# EAGLE design BOSS-RoboClaw-Interface (EAGLE 9.6.2)
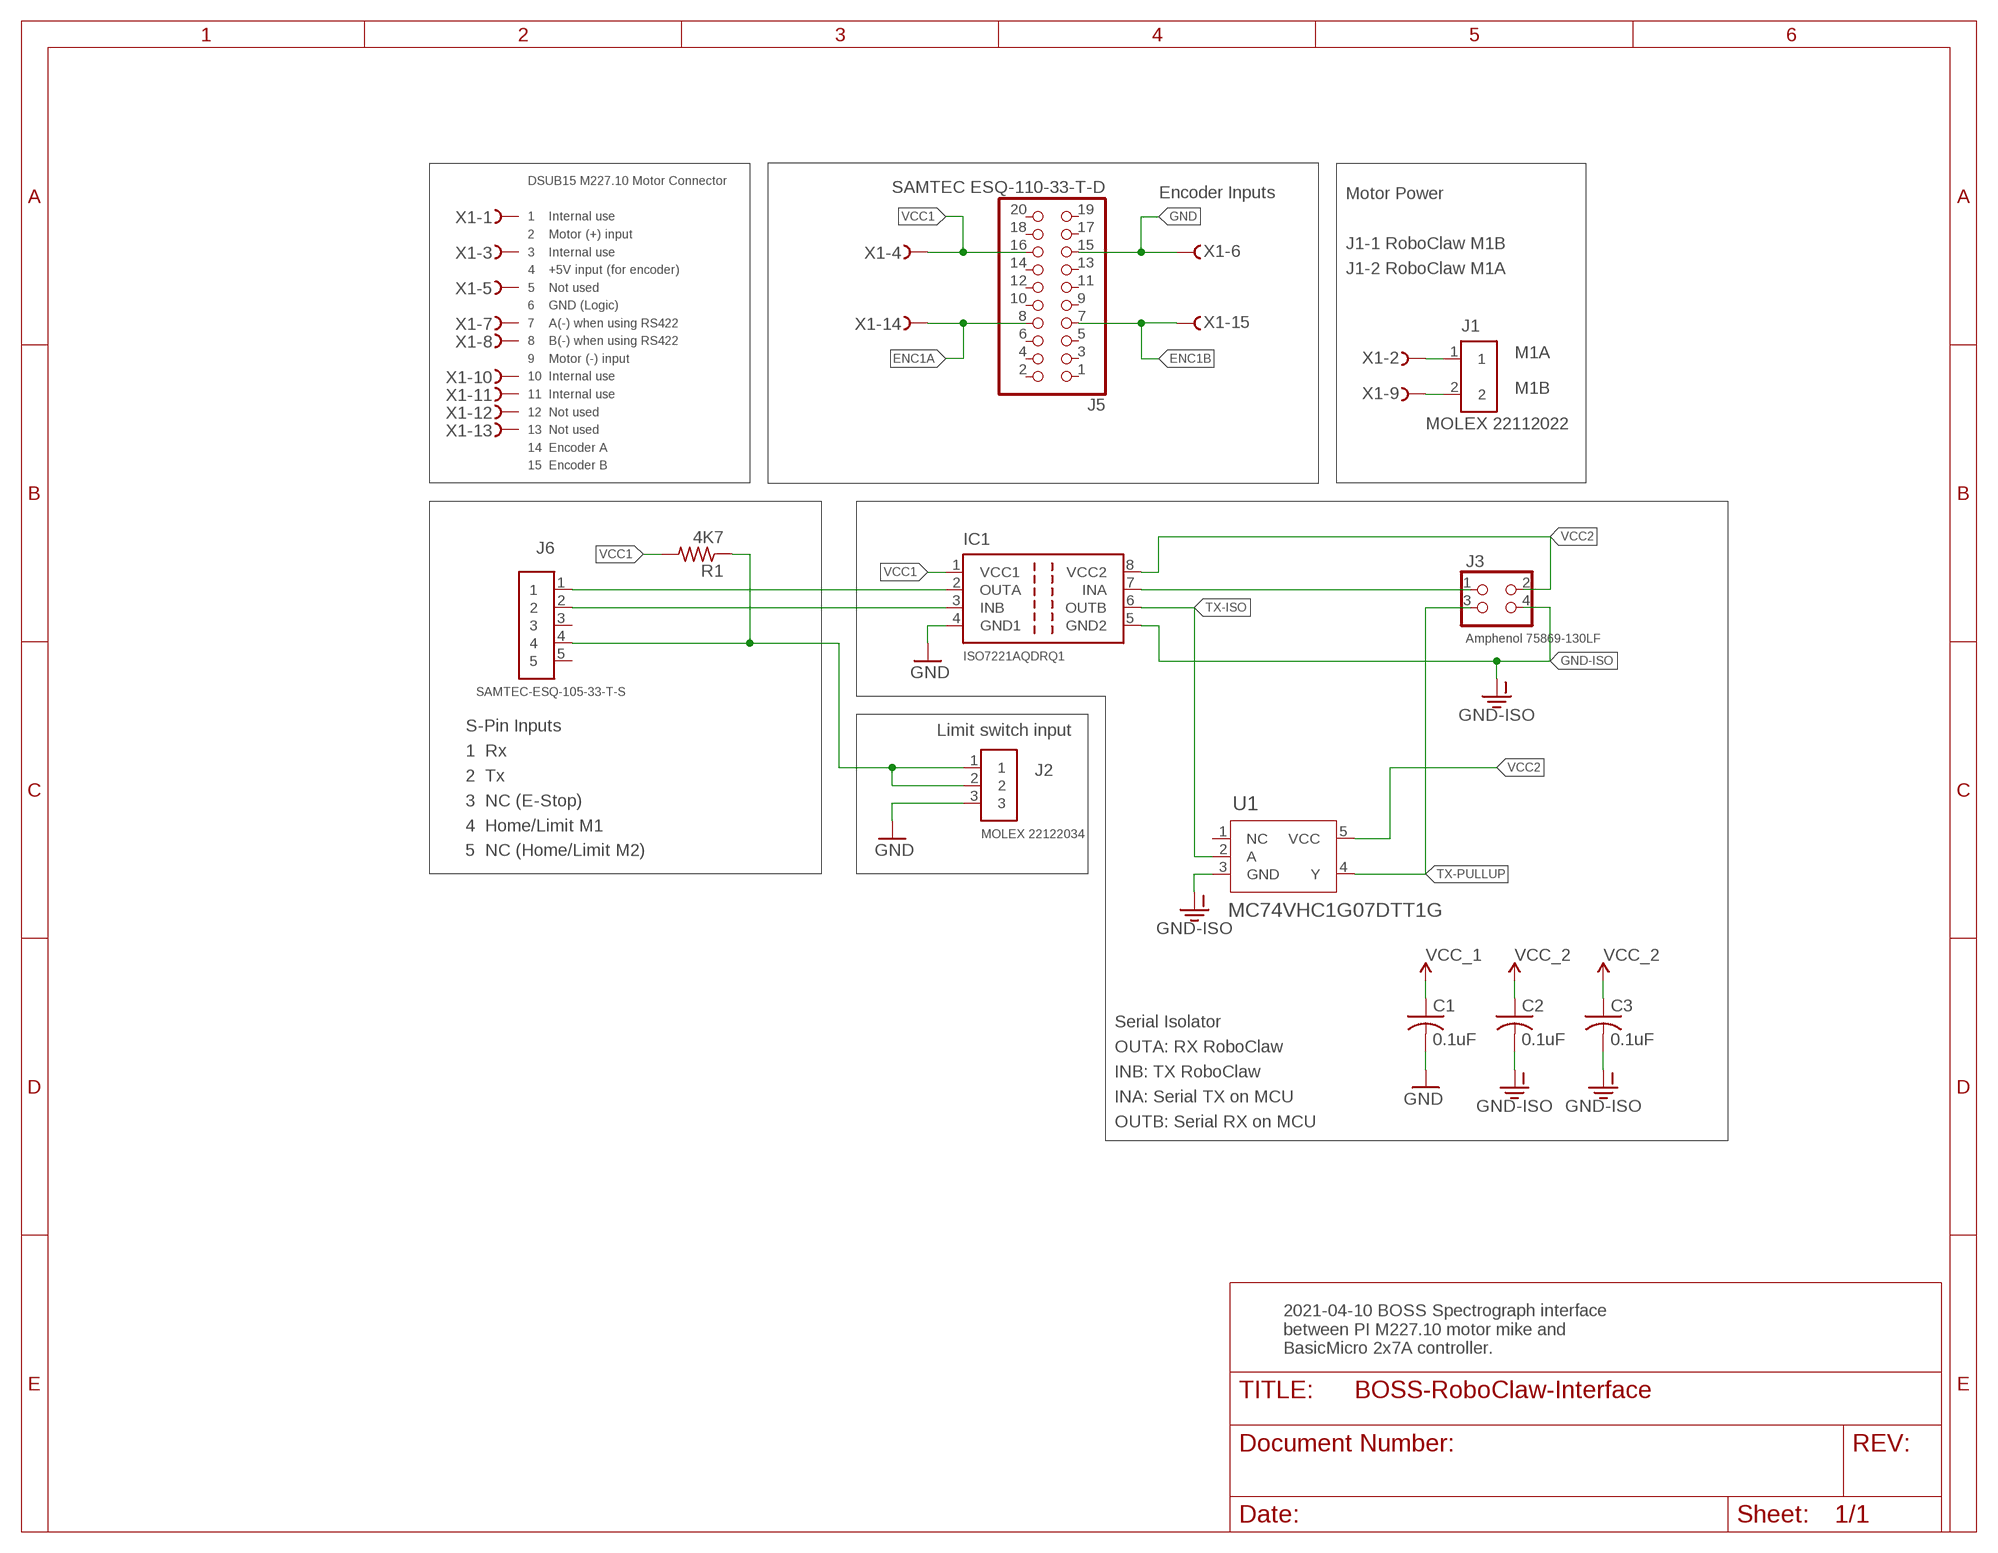
[diagram p0: schematic, sheet 1]

## Parts
C1  0.1uF  C-USC0805  [C0805]
C2  0.1uF  C-USC0805  [C0805]
C3  0.1uF  C-USC0805  [C0805]
IC1  ISO7221AQDRQ1  ISO7221ISO7221  [SO-08-ISO7221]
J1  MOLEX 22112022  PINHD-1X2-MOLEX-22112022  [1X02-MOLEX-22112022]
J2  MOLEX 22122034  PINHD-1X3RA-MOLEX-22122034  [1X03RA-MOLEX-22122034]
J3  Amphenol 75869-130LF  PINHD-2X2AMP-75869-130LF  [2X02-SHROUD]
J5  SAMTEC ESQ-110-33-T-D  PINHD-2X10-ESQ-110-33-T-DSAMTEC  [2X10-ESQ-110-33-T-D]
J6  SAMTEC-ESQ-105-33-T-S  PINHD-1X5-ESQ-105-33-T-S  [1X05-ESQ-105-33-T-S]
R1  4K7  R-US_R0805  [R0805]
U1  MC74VHC1G07DTT1G  MC74VHC1G07DTT1GSOT23-5_ONS-M  [SOT23-5_ONS-M]
X1  Amphenol L77SDAH15SOL2RM8C309  D-SUB15-H2R15ST  [H2R15ST]

## Nets
ENC1A: J5.8 X1.14
ENC1B: J5.7 X1.15
GND: C1.2 IC1.4(GND1) J2.3 J5.15 X1.6
GND-ISO: C2.2 C3.2 IC1.5(GND2) J3.4 U1.3(GND)
LIMIT: J2.1 J2.2 J6.4 R1.1
M1A: J1.1 X1.2
M1B: J1.2 X1.9
ROBO-RX: IC1.2(OUTA) J6.1
ROBO-TX: IC1.3(INB) J6.2
RX: IC1.7(INA) J3.1
TX-ISO: IC1.6(OUTB) U1.2(A)
TX-PULLUP: J3.3 U1.4(Y)
VCC1: C1.1 IC1.1(VCC1) J5.16 R1.2 X1.4 ; supply symbol labelled VCC_1
VCC2: C2.1 C3.1 IC1.8(VCC2) J3.2 U1.5(VCC) ; supply symbol labelled VCC_2
Unconnected: J5.1 J5.2 J5.3 J5.4 J5.5 J5.6 J5.9 J5.10 J5.11 J5.12 J5.13 J5.14 J5.17 J5.18 J5.19 J5.20 J6.3 J6.5 U1.1(NC) X1.1 X1.3 X1.5 X1.7 X1.8 X1.10 X1.11 X1.12 X1.13

## Notes on the sheet
- Encoder Inputs
- Motor Power
  
  J1-1 RoboClaw M1B
  J1-2 RoboClaw M1A
- DSUB15 M227.10 Motor Connector
  
  1    Internal use
  2    Motor (+) input
  3    Internal use
  4    +5V input (for encoder)
  5    Not used
  6    GND (Logic)
  7    A(-) when using RS422
  8    B(-) when using RS422
  9    Motor (-) input
  10  Internal use
  11  Internal use
  12  Not used
  13  Not used
  14  Encoder A
  15  Encoder B
- Limit switch input
- S-Pin Inputs
  1  Rx
  2  Tx
  3  NC (E-Stop)
  4  Home/Limit M1
  5  NC (Home/Limit M2)
- Serial Isolator
  OUTA: RX RoboClaw
  INB: TX RoboClaw
  INA: Serial TX on MCU
  OUTB: Serial RX on MCU
- 2021-04-10 BOSS Spectrograph interface
  between PI M227.10 motor mike and
  BasicMicro 2x7A controller.

## Library data of the parts
C1-C3 = AUmlib:C-US: CAPACITOR, American symbol; SPICEPREFIX: C
IC1 = AUmlib:ISO7221: DUAL DIGITAL ISOLATORS Source: http://focus.ti.com/lit/ds/symlink/iso7221a.pdf
J1 = AUmlib:PINHD-1X2-MOLEX-22112022
J2 = AUmlib:PINHD-1X3RA-MOLEX-22122034
J3 = AUmlib:PINHD-2X2: PIN HEADER
J5 = AUmlib:PINHD-2X10-ESQ-110-33-T-D: PIN HEADER
J6 = AUmlib:PINHD-1X5-ESQ-105-33-T-S
R1 = AUmlib:R-US_: RESISTOR, American symbol; SPICEPREFIX: R
U1 = AUmlib:MC74VHC1G07DTT1G; COPYRIGHT: Copyright (C) 2022 Ultra Librarian. All rights reserved.; DIGI-KEY_PART_NUMBER_1: MC74VHC1G07DTT1GOSCT-ND; DIGI-KEY_PART_NUMBER_2: MC74VHC1G07DTT1GOSDKR-ND; DIGI-KEY_PART_NUMBER_3: MC74VHC1G07DTT1GOSTR-ND; DIGI-KEY_PART_NUMBER_4: 2156-MC74VHC1G07DTT1G-OS-ND; MANUFACTURER_PART_NUMBER: MC74VHC1G07DTT1G; MFR_NAME: onsemi
X1 = AUmlib:D-SUB15-: D-Subminiatur Connector Source: Electronioc Interconnects European Edition 1998; OC_FARNELL: unknown; OC_NEWARK: unknown

## Board
Basic Micro 2x7A RoboClaw interface to PI M-227.10 motor mikel.
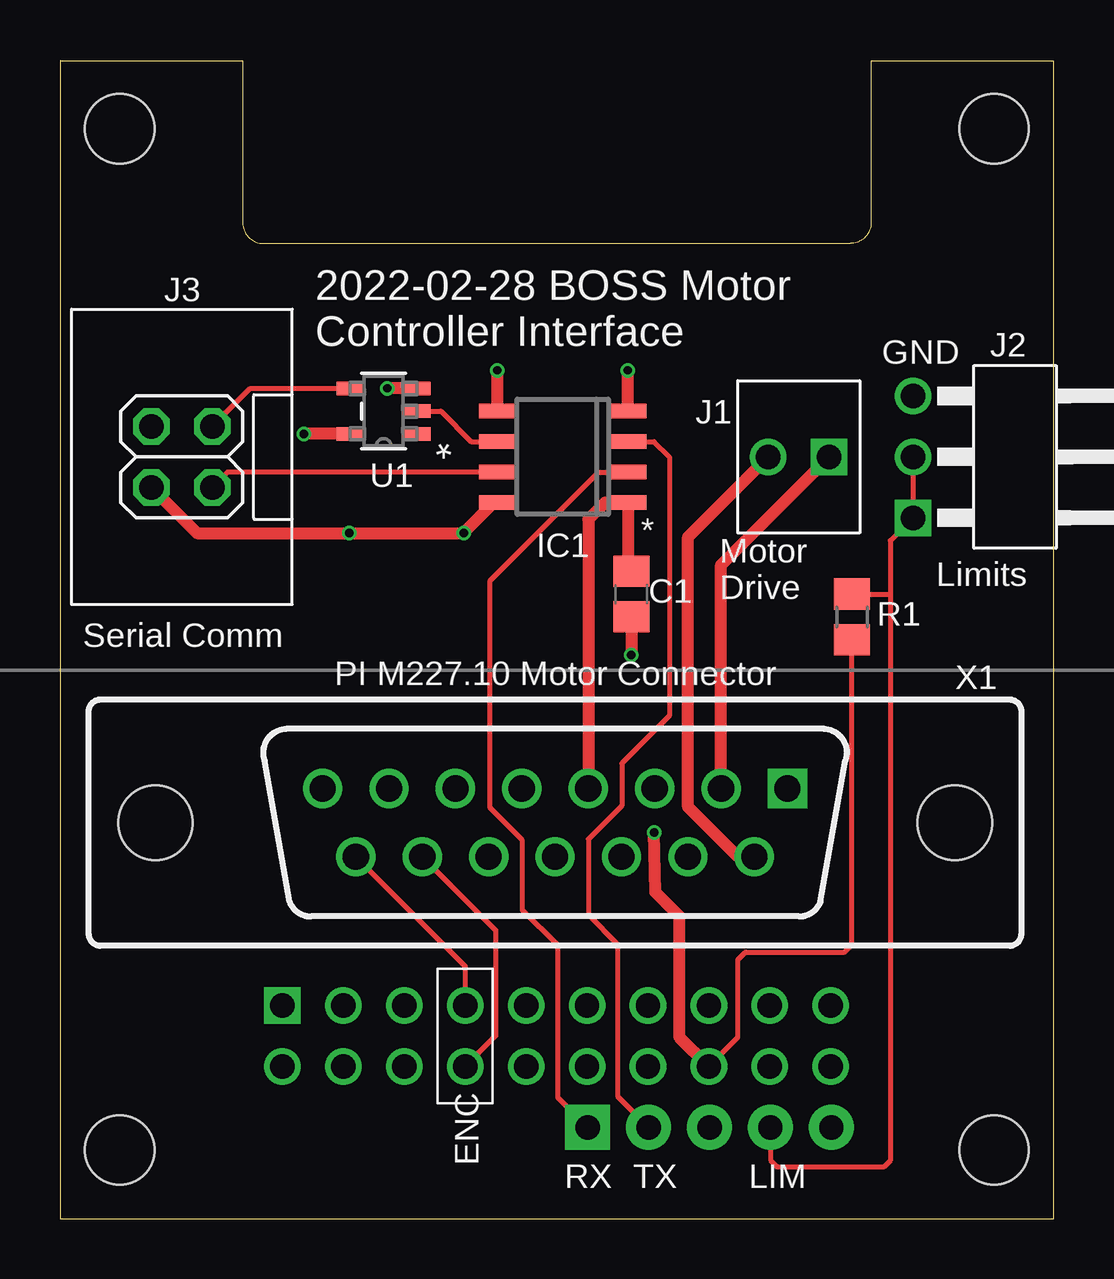
[diagram p1: board, top side]
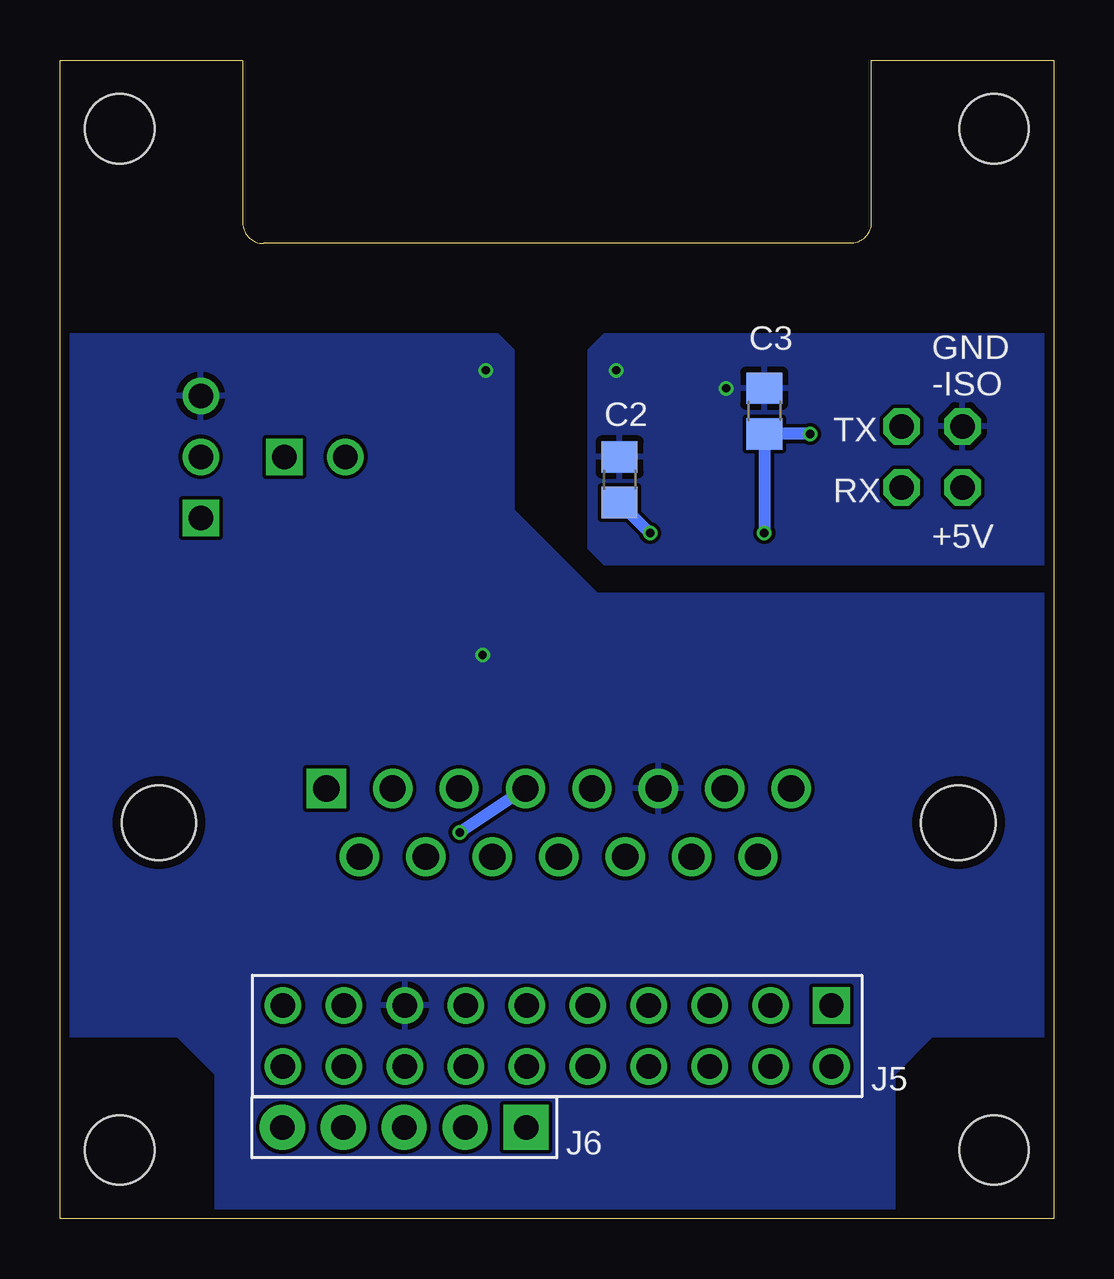
[diagram p2: board, bottom side, seen from below]

Size 41.43 x 48.29 mm. Coordinates in mm from the lower left corner, seen from the top.
Outline: 0,48.28 0,48.26
Outline: 0,48.26 0,0 41.43,0 41.43,48.26 33.81,48.26 33.81,41.5 arc-90 32.94,40.64 8.48,40.64 arc-90 7.62,41.5 7.62,48.26 0,48.26
Copper layers (1*16): Top 0.035559375mm / dielectric 1.6mm / Bottom 0.035559375mm
Design rules "oshpark-2layer": minimum track width 6mil, minimum drill 10mil, track to track 6mil, track to pad 6mil, pad to pad 6mil, via to via 6mil, smd to smd 6mil, copper to edge 15mil, drill to drill 6mil, minimum pad ring 5mil, minimum via ring 5mil, stop-mask expansion 2.5mil, vias tented up to drill 0mil, thermal gap 10mil
Holes 2.9 mm at 2.49,2.87 2.49,45.42 38.94,45.42 38.94,2.87

### Footprints (pad centres in the part's own frame; a part is rotated, then mirrored left to right if it is on the bottom)
C0805 = smd 1.3 x 1.5: 1 -0.95,0; 2 0.95,0
SO-08-ISO7221 = smd 1.549 x 0.61: 1 -2.718,1.905; 2 -2.718,0.635; 3 -2.718,-0.635; 4 -2.718,-1.905; 5 2.718,-1.905; 6 2.718,-0.635; 7 2.718,0.635; 8 2.718,1.905
1X02-MOLEX-22112022 = drill 1.016 square: 1 -1.27,0 | drill 1.016: 2 1.27,0
1X03RA-MOLEX-22122034 = drill 1.016 square: 1 -2.54,3.81 | drill 1.016: 2 0,3.81; 3 2.54,3.81
2X02-SHROUD = drill 1.016 octagon: 1 -1.27,-1.27; 2 -1.27,1.27; 3 1.27,-1.27; 4 1.27,1.27
2X10-ESQ-110-33-T-D = drill 1.016 square: 1 -11.43,-1.27 | drill 1.016: 2 -11.43,1.27; 3 -8.89,-1.27; 4 -8.89,1.27; 5 -6.35,-1.27; 6 -6.35,1.27; 7 -3.81,-1.27; 8 -3.81,1.27; 9 -1.27,-1.27; 10 -1.27,1.27; 11 1.27,-1.27; 12 1.27,1.27; 13 3.81,-1.27; 14 3.81,1.27; 15 6.35,-1.27; 16 6.35,1.27; 17 8.89,-1.27; 18 8.89,1.27; 19 11.43,-1.27; 20 11.43,1.27
1X05-ESQ-105-33-T-S = drill 1.016 pad 1.88 square: 1 -5.08,0 | drill 1.016 pad 1.88: 2 -2.54,0; 3 0,0; 4 2.54,0; 5 5.08,0
R0805 = smd 1.3 x 1.5: 1 -0.95,0; 2 0.95,0
SOT23-5_ONS-M = smd 1.156 x 0.559: 1 -1.378,0.95; 2 -1.378,0; 3 -1.378,-0.95; 4 1.378,-0.95; 5 1.378,0.95
H2R15ST = drill 1.092 square: 1 9.69,1.422 | drill 1.092: 2 6.921,1.422; 3 4.153,1.422; 4 1.384,1.422; 5 -1.384,1.422; 6 -4.153,1.422; 7 -6.921,1.422; 8 -9.69,1.422; 9 8.306,-1.422; 10 5.537,-1.422; 11 2.769,-1.422; 12 0,-1.422; 13 -2.769,-1.422; 14 -5.537,-1.422; 15 -8.306,-1.422 | hole 3.1: -16.662,0; 16.662,0

### Placement (x,y rotation side)
C1  23.81,26.04 270 top
C2  18.1,30.8 90 bottom
C3  12.06,33.66 90 bottom
IC1  20.95,31.75 180 top
J1  30.8,31.75 180 top
J2  39.37,31.75 90 top
J3  5.08,31.75 90 top
J5  20.7,7.62 180 bottom
J6  27.08,3.81 180 bottom
R1  33.02,25.08 270 top
U1  13.49,33.66 180 top
X1  20.64,16.51 0 top

### Tracks (layer width: path | path; a pad name or v marks a point on that pad's centre or on a via)
ENC1A
  Top 0.203: X1.14 18.16,12.03 18.16,7.62 J5.8
ENC1B
  Top 0.203: X1.15 16.89,10.53 J5.7
GND  (via drill 0.35)
  Top 0.508: IC1.4 v23.67,35.36 | C1.2 v23.81,23.5
  pour Bottom: 22.54,36.2 23.18,36.83 41.43,36.83 41.43,7.62 36.51,7.62 34.92,6.03 34.92,0 6.67,0 6.67,6.03 5.08,7.62 0,7.62 0,26.04 19.05,26.04 22.54,29.53
GND-ISO  (via drill 0.35)
  Top 0.508: IC1.5 v18.24,35.36 | U1.3 v13.65,34.6 v13.65,34.61
  pour Bottom: 0,27.3 18.73,27.3 19.37,27.94 19.37,36.2 18.73,36.83 0,36.83
LIMIT
  Top 0.203: J2.2 J2.1 34.61,28.26 34.61,26.04 | 34.61,26.04 34.61,2.43 34.34,2.16 29.91,2.16 29.62,2.45 J6.4 | R1.1 34.61,26.04
M1A
  Top 0.508: X1.2 27.56,27.24 J1.1
M1B
  Top 0.508: X1.9 28.27,15.09 26.19,17.17 26.19,28.41 J1.2
ROBO-RX
  Top 0.203: IC1.2 22.45,31.11 17.93,26.59 17.93,17.12 19.28,15.77 19.28,12.87 20.75,11.39 20.75,5.05 J6.1
ROBO-TX
  Top 0.203: J6.2 23.27,5.08 23.27,11.43 22.02,12.68 22.02,15.82 23.42,17.22 23.42,18.97 25.4,20.95 25.4,31.75 24.77,32.38 IC1.3
RX
  Top 0.203: J3.1 6.99,31.11 IC1.7
TX-ISO
  Top 0.203: IC1.6 17.14,32.38 15.88,33.66 U1.2
TX-PULLUP
  Top 0.203: J3.3 7.93,34.6 U1.4
VCC1  (via drill 0.35)
  Top 0.203: J5.16 28.26,7.56 28.26,10.79 28.57,11.11 32.7,11.11 33.02,11.43 R1.2
  Top 0.508: v24.77,16.1 24.82,13.61 25.81,12.62 25.81,7.59 J5.16 | X1.4 22.02,29.15 22.72,29.84 IC1.1 23.67,27.12 C1.1
  Bottom 0.508: v24.77,16.1 X1.4
VCC2  (via drill 0.35)
  Top 0.508: J3.2 5.71,28.57 v12.06,28.57 v16.83,28.57 16.83,28.59 18.08,29.84 IC1.8 | v10.16,32.7 U1.5
  Bottom 0.508: v16.83,28.57 C2.1 | v10.16,32.7 C3.1 v12.06,28.57

### Text on the board
tPlace: 2022-02-28 BOSS Motor / Controller Interface | GND | Motor / Drive | Limits | Serial Comm | PI M227.10 Motor Connector | ENC | RX | TX | LIM
bPlace: GND / -ISO | TX | RX | +5V
tDocu: PI DB-15 Motor Connector Edge